# EAGLE design Root (EAGLE 9.6.2)
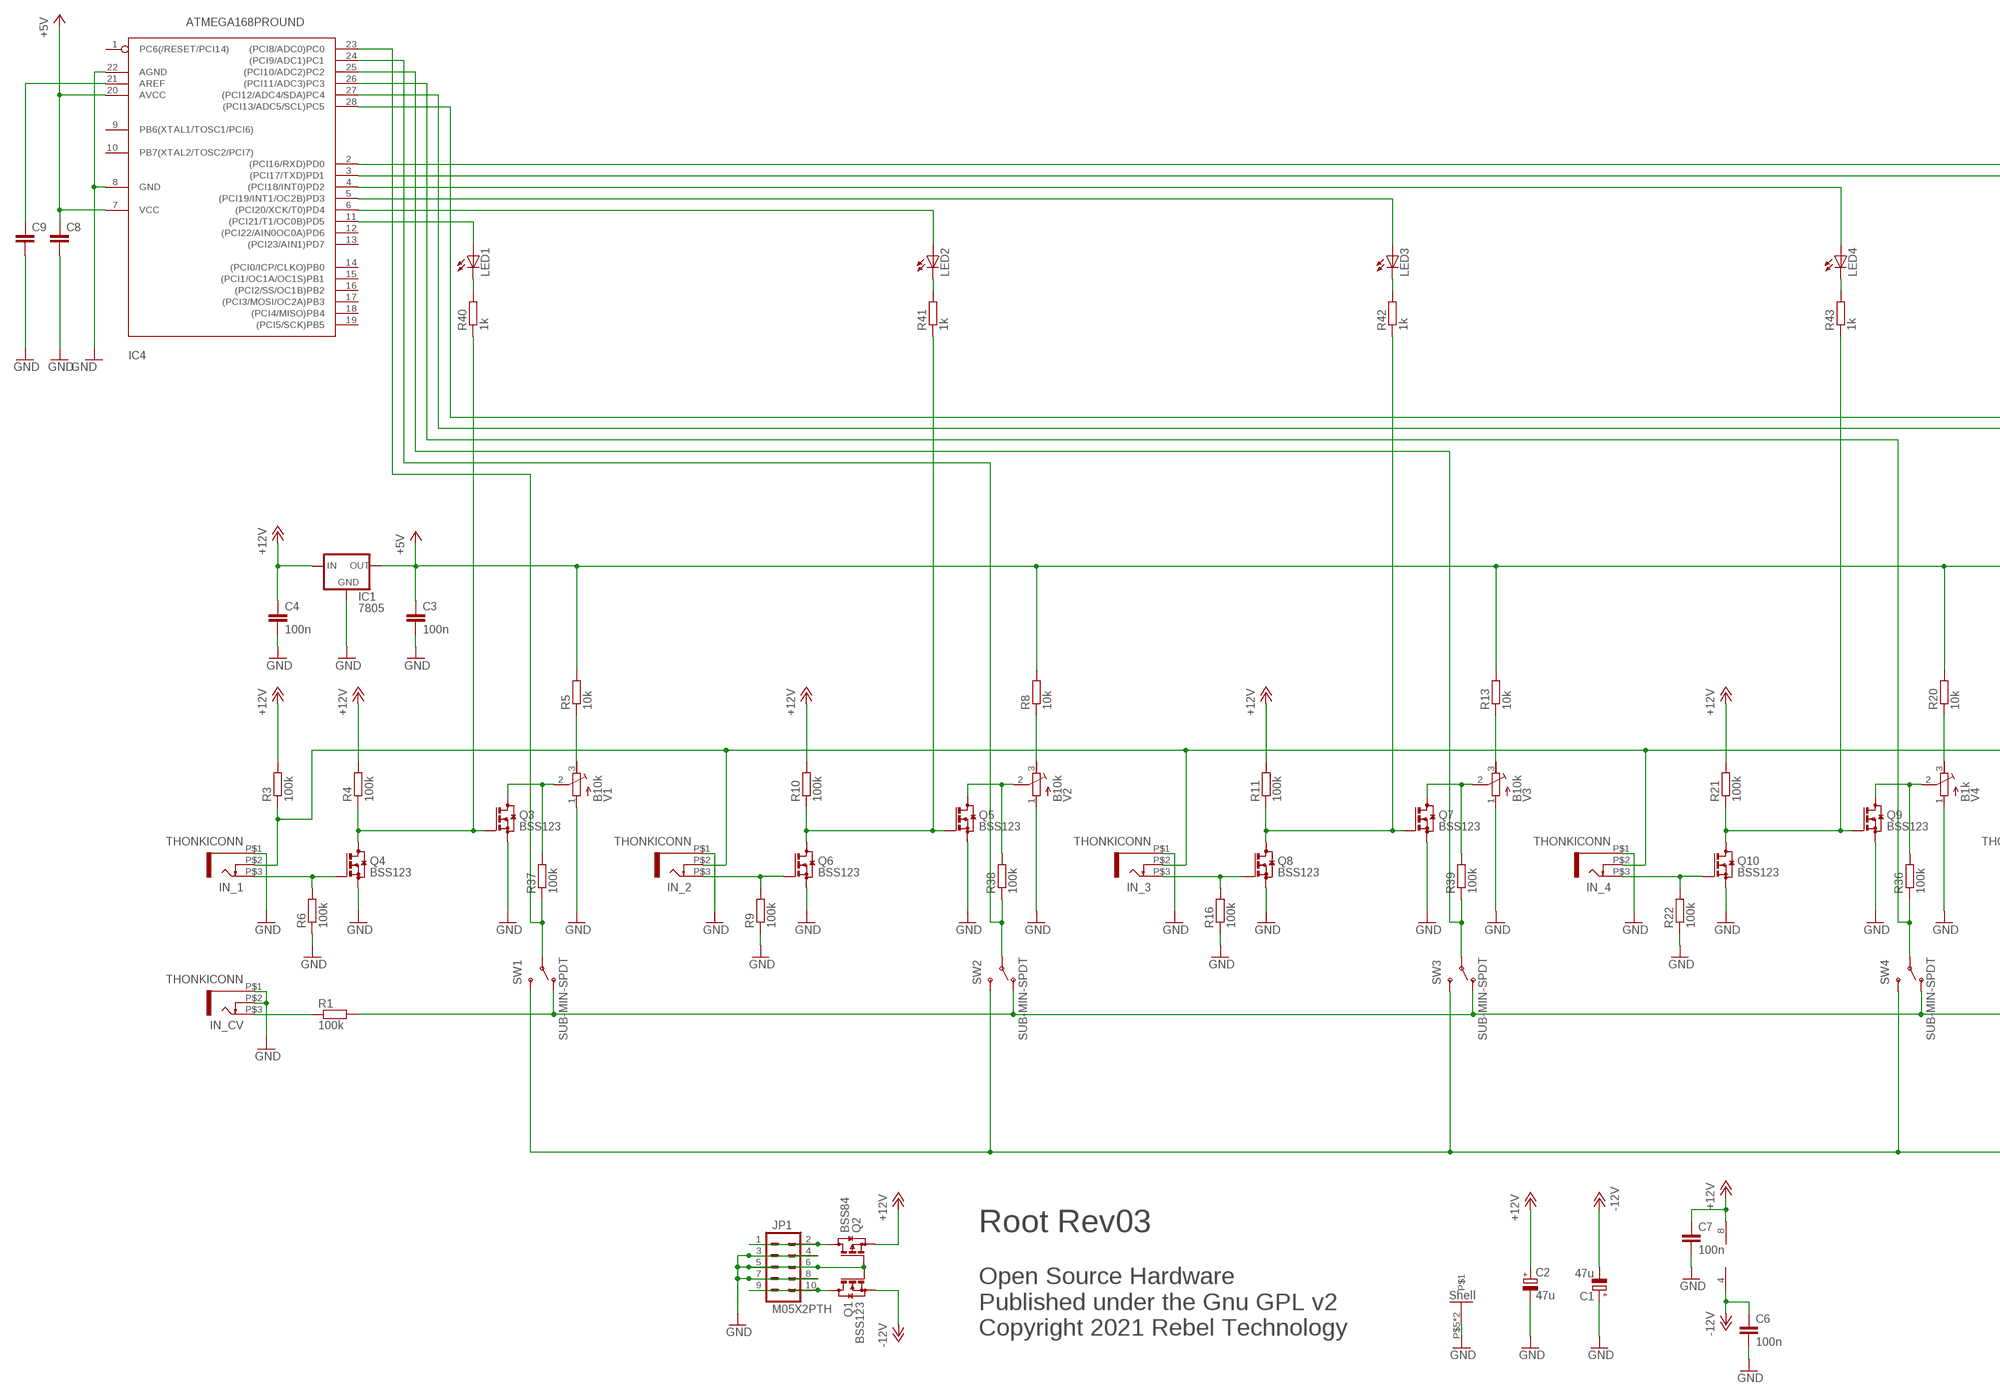
[diagram p0: schematic, sheet 1, part 1 of 2]
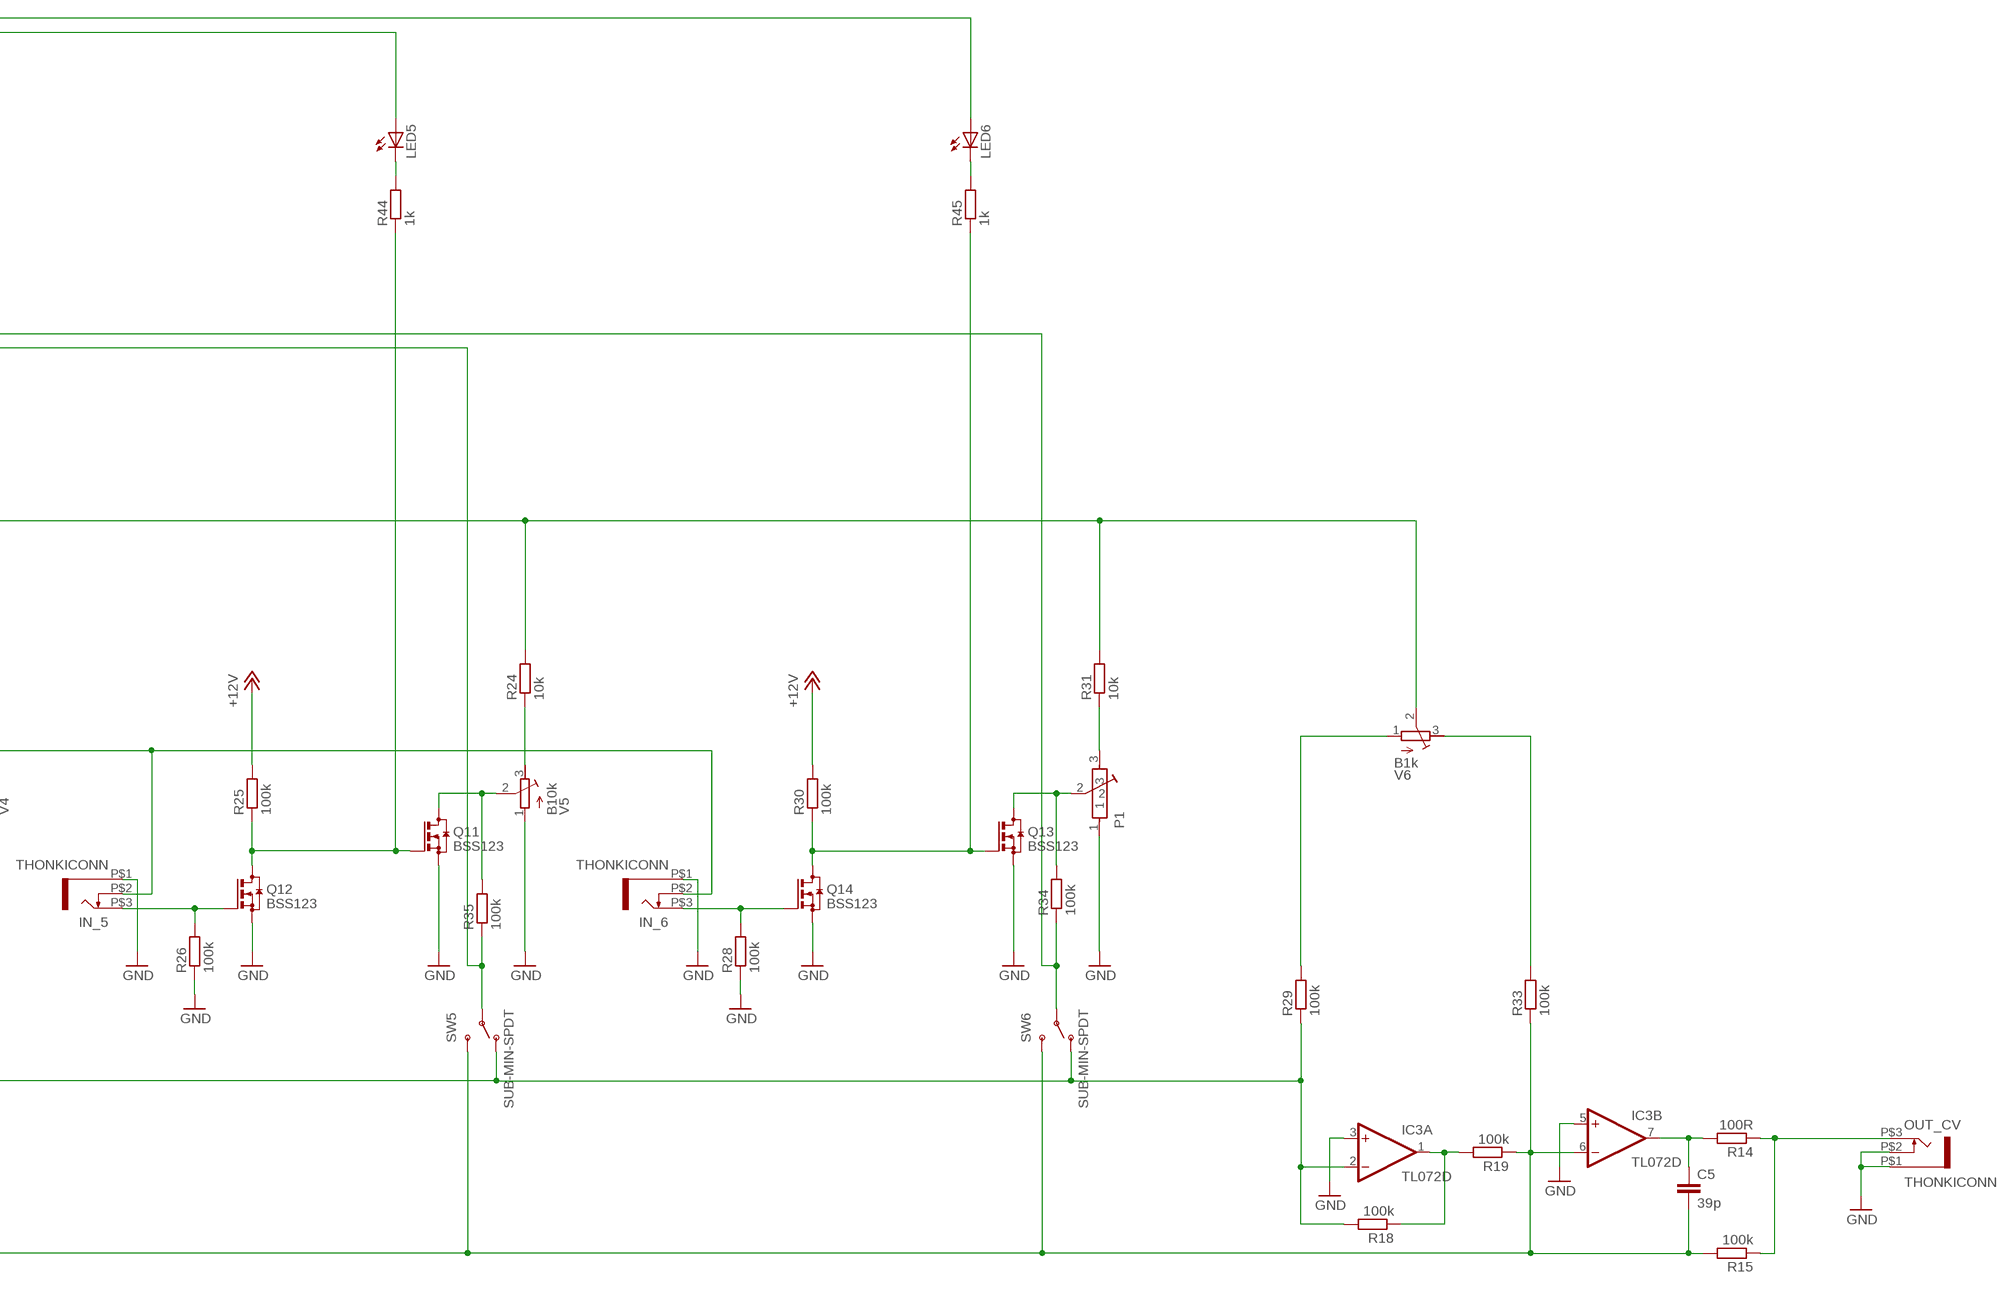
[diagram p1: schematic, sheet 1, part 2 of 2]

## Parts
C1  47u  CPOL-EUE5-6  [E5-6]
C2  47u  CPOL-EUE5-6  [E5-6]
C3  100n  C-EUC0603  [C0603]
C4  100n  C-EUC0603  [C0603]
C5  39p  C-EUC0603  [C0603]
C6  100n  C-EUC0603  [C0603]
C7  100n  C-EUC0603  [C0603]
C8  C-EUC0603  [C0603]
C9  C-EUC0603  [C0603]
IC1  7805  V_REG_78XXTO-92  [TO-92]
IC3  TL072D  [SO08]
IC4  ATMEGA168PROUND  [DIL28-3-ROUND]
IN_1  THONKICONN  [THONKICONN]
IN_2  THONKICONN  [THONKICONN]
IN_3  THONKICONN  [THONKICONN]
IN_4  THONKICONN  [THONKICONN]
IN_5  THONKICONN  [THONKICONN]
IN_6  THONKICONN  [THONKICONN]
IN_CV  THONKICONN  [THONKICONN]
JP1  M05X2PTH  [AVR_ICSP]
LED1  LED3MM  [LED3MM]
LED2  LED3MM  [LED3MM]
LED3  LED3MM  [LED3MM]
LED4  LED3MM  [LED3MM]
LED5  LED3MM  [LED3MM]
LED6  LED3MM  [LED3MM]
OUT_CV  THONKICONN  [THONKICONN]
P1  B1k  POT-ALPS-RK09L1140  [POT-ALPS-RK09L1140]
Q1  BSS123  [SOT23]
Q2  BSS84  [SOT23]
Q3  BSS123  [SOT23]
Q4  BSS123  [SOT23]
Q5  BSS123  [SOT23]
Q6  BSS123  [SOT23]
Q7  BSS123  [SOT23]
Q8  BSS123  [SOT23]
Q9  BSS123  [SOT23]
Q10  BSS123  [SOT23]
Q11  BSS123  [SOT23]
Q12  BSS123  [SOT23]
Q13  BSS123  [SOT23]
Q14  BSS123  [SOT23]
R1  100k  R-EU_0603  [0603]
R3  100k  R-EU_0603  [0603]
R4  100k  R-EU_0603  [0603]
R5  10k  R-EU_0603  [0603]
R6  100k  R-EU_0603  [0603]
R8  10k  R-EU_0603  [0603]
R9  100k  R-EU_0603  [0603]
R10  100k  R-EU_0603  [0603]
R11  100k  R-EU_0603  [0603]
R13  10k  R-EU_0603  [0603]
R14  100R  R-EU_0603  [0603]
R15  100k  R-EU_0603  [0603]
R16  100k  R-EU_0603  [0603]
R18  100k  R-EU_0603  [0603]
R19  100k  R-EU_0603  [0603]
R20  10k  R-EU_0603  [0603]
R21  100k  R-EU_0603  [0603]
R22  100k  R-EU_0603  [0603]
R24  10k  R-EU_0603  [0603]
R25  100k  R-EU_0603  [0603]
R26  100k  R-EU_0603  [0603]
R28  100k  R-EU_0603  [0603]
R29  100k  R-EU_0603  [0603]
R30  100k  R-EU_0603  [0603]
R31  10k  R-EU_0603  [0603]
R33  100k  R-EU_0603  [0603]
R34  100k  R-EU_0603  [0603]
R35  100k  R-EU_0603  [0603]
R36  100k  R-EU_0603  [0603]
R37  100k  R-EU_0603  [0603]
R38  100k  R-EU_0603  [0603]
R39  100k  R-EU_0603  [0603]
R40  1k  R-EU_0603  [0603]
R41  1k  R-EU_0603  [0603]
R42  1k  R-EU_0603  [0603]
R43  1k  R-EU_0603  [0603]
R44  1k  R-EU_0603  [0603]
R45  1k  R-EU_0603  [0603]
SW1  SUB-MIN-SPDT  [SUB-MIN-SPDT]
SW2  SUB-MIN-SPDT  [SUB-MIN-SPDT]
SW3  SUB-MIN-SPDT  [SUB-MIN-SPDT]
SW4  SUB-MIN-SPDT  [SUB-MIN-SPDT]
SW5  SUB-MIN-SPDT  [SUB-MIN-SPDT]
SW6  SUB-MIN-SPDT  [SUB-MIN-SPDT]
V1  B10k  R-TRIMM3296W  [RTRIM3296W]
V2  B10k  R-TRIMM3296W  [RTRIM3296W]
V3  B10k  R-TRIMM3296W  [RTRIM3296W]
V4  B1k  R-TRIMM3296W  [RTRIM3296W]
V5  B10k  R-TRIMM3296W  [RTRIM3296W]
V6  B1k  R-TRIMM3296W  [RTRIM3296W]

## Nets
+5V: C3.1 C8.1 IC1.3(OUT) IC4.7(VCC) IC4.20(AVCC) R5.2 R8.2 R13.2 R20.2 R24.2 R31.2 V6.2(S)
+12V: C2.+ C4.1 C7.1 IC1.2(IN) IC3.8(P:V+) Q2.2(S) R3.2 R4.2 R10.2 R11.2 R21.2 R25.2 R30.2
-12V: C1.- C6.1 IC3.4(P:V-) Q1.2(S)
GND: C1.+ C2.- C3.2 C4.2 C6.2 C7.2 C8.2 C9.2 IC1.1(GND) IC3.3(A:+IN) IC3.5(B:+IN) IC4.8(GND) IC4.22(AGND) IN_1.P$1 IN_2.P$1 IN_3.P$1 IN_4.P$1 IN_5.P$1 IN_6.P$1 IN_CV.P$1 IN_CV.P$2 JP1.3 JP1.4 JP1.5 JP1.6 JP1.7 JP1.8 OUT_CV.P$1 OUT_CV.P$2 P1.1 P1.P$5 P1.P$6 Q1.1(G) Q2.1(G) Q3.2(S) Q4.2(S) Q5.2(S) Q6.2(S) Q7.2(S) Q8.2(S) Q9.2(S) Q10.2(S) Q11.2(S) Q12.2(S) Q13.2(S) Q14.2(S) R6.1 R9.1 R16.1 R22.1 R26.1 R28.1 V1.1(A) V2.1(A) V3.1(A) V4.1(A) V5.1(A)
N$1: Q3.3(D) R37.2 V1.2(S)
N$2: OUT_CV.P$3 R14.1 R15.1
N$3: IN_1.P$3 Q4.1(G) R6.2
N$4: JP1.9 JP1.10 Q1.3(D)
N$5: R8.1 V2.3(E)
N$6: C9.1 IC4.21(AREF)
N$7: IC4.23((PCI8/ADC0)PC0) R37.1 SW1.2(P)
N$8: Q5.3(D) R38.2 V2.2(S)
N$9: Q7.3(D) R39.2 V3.2(S)
N$10: Q9.3(D) R36.2 V4.2(S)
N$11: P1.2 Q13.3(D) R34.2
N$12: Q11.3(D) R35.2 V5.2(S)
N$13: IN_2.P$3 Q6.1(G) R9.2
N$15: IN_1.P$2 IN_2.P$2 IN_3.P$2 IN_4.P$2 IN_5.P$2 IN_6.P$2 R3.1
N$16: Q5.1(G) Q6.3(D) R10.1 R41.1
N$18: IC4.24((PCI9/ADC1)PC1) R38.1 SW2.2(P)
N$20: IN_CV.P$3 R1.1
N$21: P1.3 R31.1
N$23: R13.1 V3.3(E)
N$25: Q3.1(G) Q4.3(D) R4.1 R40.1
N$26: IN_3.P$3 Q8.1(G) R16.2
N$28: Q7.1(G) Q8.3(D) R11.1 R42.1
N$29: R29.2 V6.1(A)
N$30: IC4.25((PCI10/ADC2)PC2) R39.1 SW3.2(P)
N$31: IC4.28((PCI13/ADC5/SCL)PC5) R34.1 SW6.2(P)
N$32: R20.1 V4.3(E)
N$33: C5.1 IC3.7(B:OUT) R14.2
N$34: IN_4.P$3 Q10.1(G) R22.2
N$35: IC3.1(A:OUT) R18.1 R19.2
N$36: LED3.K(C) R42.2
N$37: Q9.1(G) Q10.3(D) R21.1 R43.1
N$38: R33.2 V6.3(E)
N$39: IC4.26((PCI11/ADC3)PC3) R36.1 SW4.2(P)
N$40: LED4.K(C) R43.2
N$41: LED5.K(C) R44.2
N$42: LED6.K(C) R45.2
N$43: R24.1 V5.3(E)
N$44: R5.1 V1.3(E)
N$45: IN_5.P$3 Q12.1(G) R26.2
N$46: Q11.1(G) Q12.3(D) R25.1 R44.1
N$47: LED1.K(C) R40.2
N$48: LED2.K(C) R41.2
N$49: IC4.11((PCI21/T1/OC0B)PD5) LED1.A
N$50: IC4.27((PCI12/ADC4/SDA)PC4) R35.1 SW5.2(P)
N$51: IC4.6((PCI20/XCK/T0)PD4) LED2.A
N$52: IN_6.P$3 Q14.1(G) R28.2
N$53: IC4.5((PCI19/INT1/OC2B)PD3) LED3.A
N$54: Q13.1(G) Q14.3(D) R30.1 R45.1
N$55: IC4.4((PCI18/INT0)PD2) LED4.A
N$56: IC4.3((PCI17/TXD)PD1) LED5.A
N$57: IC4.2((PCI16/RXD)PD0) LED6.A
N$79: JP1.1 JP1.2 Q2.3(D)
NEG: C5.2 IC3.6(B:-IN) R15.2 R19.1 R33.1 SW1.3(S) SW2.3(S) SW3.3(S) SW4.3(S) SW5.3(S) SW6.3(S)
POS: IC3.2(A:-IN) R1.2 R18.2 R29.1 SW1.1(O) SW2.1(O) SW3.1(O) SW4.1(O) SW5.1(O) SW6.1(O)
Unconnected: IC4.1(PC6(/RESET/PCI14)) IC4.9(PB6(XTAL1/TOSC1/PCI6)) IC4.10(PB7(XTAL2/TOSC2/PCI7)) IC4.12((PCI22/AIN0OC0A)PD6) IC4.13((PCI23/AIN1)PD7) IC4.14((PCI0/ICP/CLKO)PB0) IC4.15((PCI1/OC1A/OC1S)PB1) IC4.16((PCI2/SS/OC1B)PB2) IC4.17((PCI3/MOSI/OC2A)PB3) IC4.18((PCI4/MISO)PB4) IC4.19((PCI5/SCK)PB5)

## Notes on the sheet
- Root Rev03
- Open Source Hardware
  Published under the Gnu GPL v2
  Copyright 2021 Rebel Technology

## Library data of the parts
C1 C2 = Rebel:CPOL-EU: POLARIZED CAPACITOR, European symbol
C3-C9 = Rebel:C-EU: CAPACITOR, European symbol
IC1 = SparkFun:V_REG_78XX: Voltage Regulator Standard 7805 5V regulator. IGO (Input Ground Output). Spark Fun Electronics SKU : COM-00107
IC3 = linear:TL072: OP AMP
IC4 = adafruit:ATMEGA168*P: MICROCONTROLLER 16 kBytes FLASH 1 kBytes SRAM 512 Bytes EEPROM USART 8-channel 10 bit ADC
IN_1-IN_6 IN_CV OUT_CV = Rebel:THONKICONN
JP1 = SparkFun:M05X2: Header 5x2 Standard 10-pin dual row 0.1" header. Commonly used with AVR-ISP. Use with Spark Fun Electronics SKU: PRT-00778
LED1-LED6 = Rebel:LED: LED
P1 = Rebel:POT-ALPS-RK09L
Q1 = transistor-small-signal:BSS123: N-CHANNEL MOS FET; OC_FARNELL: 1843725
Q2 = transistor-small-signal:BSS84: P-CHANNEL MOS FET; OC_FARNELL: 1779264
Q3-Q14 = transistor-small-signal:BSS123: N-CHANNEL MOS FET
R1 R3-R6 R8-R11 R13-R16 R18-R22 R24-R26 R28-R31 R33-R45 = Rebel:R-EU_: RESISTOR, European symbol
SW1-SW6 = Rebel:SUB-MIN-SPDT
V1-V6 = resistor:R-TRIMM: Trimm resistor

## Module TRIGGER
Ports: TR_IN(io)

### Library data of the parts

## Board
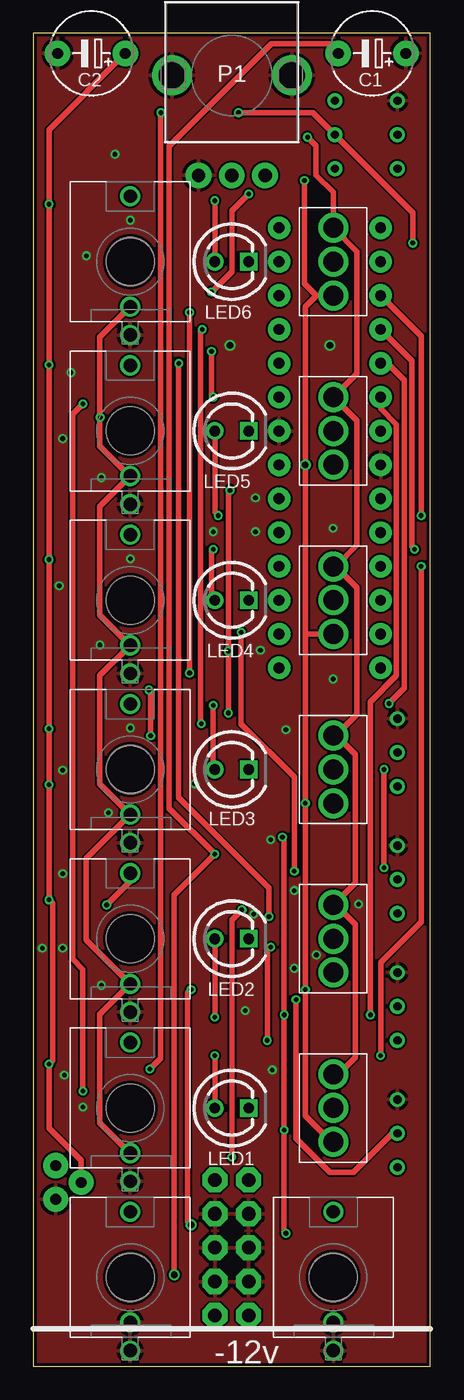
[diagram p2: board, top side]
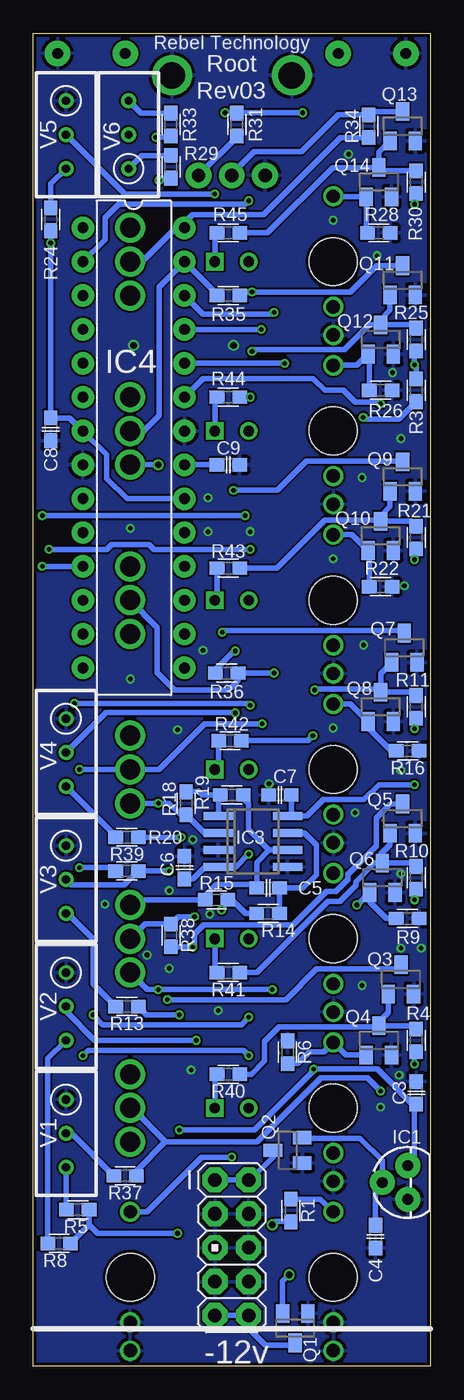
[diagram p3: board, bottom side, seen from below]

Size 29.8 x 100 mm. Coordinates in mm from the lower left corner, seen from the top.
Outline: 29.8,0 29.8,100 0,100 0,0 29.8,0
Copper layers (1*16): Top 0.035mm / dielectric 1.5mm / Bottom 0.035mm
Design rules "SeeedStudio_2layer_DRU_no_angle_20140221": minimum track width 6mil, minimum drill 12mil, track to track 6mil, track to pad 6mil, pad to pad 6mil, via to via 6mil, smd to smd 0mil, copper to edge 10mil, drill to drill 10mil, minimum pad ring 10mil, minimum via ring 6mil, stop-mask expansion 2mil, vias tented up to drill 100mil, thermal gap 10mil

### Footprints (pad centres in the part's own frame; a part is rotated, then mirrored left to right if it is on the bottom)
E5-6 = drill 0.813 pad 1.905: + -2.54,0; - 2.54,0
C0603 = smd 1.1 x 1: 1 -0.85,0; 2 0.85,0
TO-92 = drill 0.813 pad 1.88: 1 -1.27,0; 2 0,1.905; 3 1.27,0
SO08 = smd 0.6 x 2.2: 1 -1.905,-2.6; 2 -0.635,-2.6; 3 0.635,-2.6; 4 1.905,-2.6; 5 1.905,2.6; 6 0.635,2.6; 7 -0.635,2.6; 8 -1.905,2.6
DIL28-3-ROUND = drill 0.813 pad 1.676: 1 -16.51,-3.81; 2 -13.97,-3.81; 3 -11.43,-3.81; 4 -8.89,-3.81; 5 -6.35,-3.81; 6 -3.81,-3.81; 7 -1.27,-3.81; 8 1.27,-3.81; 9 3.81,-3.81; 10 6.35,-3.81; 11 8.89,-3.81; 12 11.43,-3.81; 13 13.97,-3.81; 14 16.51,-3.81; 15 16.51,3.81; 16 13.97,3.81; 17 11.43,3.81; 18 8.89,3.81; 19 6.35,3.81; 20 3.81,3.81; 21 1.27,3.81; 22 -1.27,3.81; 23 -3.81,3.81; 24 -6.35,3.81; 25 -8.89,3.81; 26 -11.43,3.81; 27 -13.97,3.81; 28 -16.51,3.81
THONKICONN = drill 1: P$1 0,-5.5; P$2 0,-3.38; P$3 0,4.92 | hole 3.6: 0,0
AVR_ICSP = drill 1.016 pad 1.88 octagon: 1 -1.27,5.08; 2 1.27,5.08; 3 -1.27,2.54; 4 1.27,2.54; 5 -1.27,0; 6 1.27,0; 7 -1.27,-2.54; 8 1.27,-2.54; 9 -1.27,-5.08; 10 1.27,-5.08
LED3MM = drill 0.813: A -1.27,0 | drill 0.813 square: K 1.27,0
POT-ALPS-RK09L1140 = drill 1 pad 1.93: 1 -2.5,-7.5; 2 0,-7.5; 3 2.5,-7.5 | drill 2: P$5 -4.5,0; P$6 4.5,0
SOT23 = smd 1 x 1.4: 1 -0.95,-1.1; 2 0.95,-1.1; 3 0,1.1
0603 = smd 1.1 x 1: 1 -0.85,0; 2 0.85,0
SUB-MIN-SPDT = drill 1.5: 1 0,-2.54; 2 0,0; 3 0,2.54
RTRIM3296W = drill 0.61: 1 0,-2.54; 2 0,0; 3 0,2.54

### Placement (x,y rotation side)
C1  25.44,98.49 180 top
C2  4.36,98.49 180 top
C3  1.06,20.51 90 bottom
C4  4.11,9.72 270 bottom
C5  12.17,35.88 180 bottom
C6  18.46,37.4 90 bottom
C7  11.28,42.86 180 bottom
C8  28.49,70.29 270 bottom
C9  15.15,67.63 0 bottom
IC1  1.69,13.78 90 bottom
IC3  13.31,39.37 270 bottom
IC4  22.27,68.9 270 bottom
IN_1  7.28,19.37 0 top
IN_2  7.28,32.07 0 top
IN_3  7.28,44.77 0 top
IN_4  7.28,57.47 0 top
IN_5  7.28,70.17 0 top
IN_6  7.28,82.87 0 top
IN_CV  7.28,6.67 0 top
JP1  14.9,8.89 0 bottom
LED1  14.9,19.37 0 top
LED2  14.9,32.07 0 top
LED3  14.9,44.77 0 top
LED4  14.9,57.47 0 top
LED5  14.9,70.17 0 top
LED6  14.9,82.87 0 top
OUT_CV  22.52,6.67 0 top
P1  14.9,96.84 0 top
Q1  10.14,2.86 180 bottom
Q2  10.71,16.19 90 bottom
Q3  2.2,29.02 0 bottom
Q4  3.85,24.45 0 bottom
Q5  2.07,41.08 0 bottom
Q6  3.6,36.64 0 bottom
Q7  1.95,53.91 0 bottom
Q8  3.72,49.47 0 bottom
Q9  2.07,66.74 0 bottom
Q10  3.72,62.29 0 bottom
Q11  2.07,81.47 0 bottom
Q12  3.72,77.03 0 bottom
Q13  2.07,93.03 0 bottom
Q14  3.85,88.84 0 bottom
R1  10.46,11.68 270 bottom
R3  1.06,73.22 90 bottom
R4  1.06,24.45 270 bottom
R5  26.46,11.75 0 bottom
R6  10.71,23.56 270 bottom
R8  27.85,9.21 0 bottom
R9  1.69,33.59 180 bottom
R10  1.06,36.64 270 bottom
R11  1.06,49.47 270 bottom
R13  22.77,26.99 0 bottom
R14  12.17,33.97 0 bottom
R15  16.04,34.99 180 bottom
R16  1.69,46.16 180 bottom
R18  18.33,42.23 270 bottom
R19  14.9,42.86 180 bottom
R20  22.77,39.69 0 bottom
R21  1.06,62.17 270 bottom
R22  3.72,58.48 180 bottom
R24  28.49,86.04 270 bottom
R25  1.06,77.03 270 bottom
R26  3.72,73.22 180 bottom
R28  3.85,85.03 180 bottom
R29  19.47,89.98 90 bottom
R30  1.06,88.84 270 bottom
R31  14.52,93.15 90 bottom
R33  19.47,93.15 90 bottom
R34  4.61,93.03 90 bottom
R35  15.15,80.33 0 bottom
R36  15.28,52.01 180 bottom
R37  22.9,14.29 180 bottom
R38  19.47,32.32 270 bottom
R39  22.77,37.15 0 bottom
R40  15.15,21.91 180 bottom
R41  15.15,29.53 180 bottom
R42  15.03,46.93 180 bottom
R43  15.15,59.88 180 bottom
R44  15.15,72.71 180 bottom
R45  15.15,85.03 180 bottom
SW1  22.52,19.37 0 top
SW2  22.52,32.07 0 top
SW3  22.52,44.77 0 top
SW4  22.52,57.47 0 top
SW5  22.52,70.17 0 top
SW6  22.52,82.87 0 top
V1  27.35,17.46 180 bottom
V2  27.35,26.99 180 bottom
V3  27.35,36.51 180 bottom
V4  27.35,46.04 180 bottom
V5  27.35,92.39 180 bottom
V6  22.65,92.39 0 bottom

### Tracks (layer width: path | path; a pad name or v marks a point on that pad's centre or on a via)
+5V  (via drill 0.35)
  Top 0.406: v15.41,94.04 21,94.04 V6.2 28.49,86.55 v28.49,84.26 | v18.71,39.69 18.84,39.56 v18.84,26.35 v18.84,17.72 18.84,10.1 v18.96,9.97 | v8.76,22.29 9.57,23.1 v9.57,94.04
  Bottom 0.406: 25.61,10.6 R5.2 | IC4.20 22.77,65.09 24.3,66.61 24.3,68.39 IC4.7 27.05,71.14 C8.1 v28.49,84.26 R24.2 | IC1.3 1.18,15.56 1.18,19.53 C3.1 1.35,19.66 3.98,22.29 v8.76,22.29 8.76,22.16 13.2,17.72 v18.84,17.72 | R31.2 14.56,94.04 | 14.56,94.04 v15.41,94.04 | R13.2 21.29,26.35 v18.84,26.35 | v9.57,94.04 14.56,94.04 | R20.2 v18.71,39.69 | v18.96,9.97 24.97,9.97 25.61,10.6 | R8.2 25.61,10.6
+12V  (via drill 0.35)
  Top 0.406: IC1.2 3.6,15.43 1.18,17.84 v1.18,22.67 1.44,22.92 1.44,34.73 v1.18,34.99 v1.18,43.62 v1.18,47.82 v1.18,60.52 v1.18,75.12 v1.18,87.19 1.18,92.77 C2.+
  Bottom 0.406: C7.1 10.43,41.56 IC3.8 9.25,41.27 8.01,42.51 4.97,42.51 3.86,43.62 v1.19,43.62 v1.18,43.62 | C4.1 4.11,13.27 IC1.2 3.6,15.43 5.26,17.1 9.56,17.1 Q2.2 | R25.2 1.18,76.05 v1.18,75.12 1.06,74.99 R3.2 | R21.2 1.18,61.19 v1.18,60.52 | R11.2 1.18,48.49 v1.18,47.82 | R10.2 1.18,35.66 v1.18,34.99 | R4.2 1.18,23.47 v1.18,22.67 | R30.2 1.18,87.86 v1.18,87.19
-12V  (via drill 0.35, 0.5)
  Top 0.406: v10.58,6.86 10.58,35.37 v13.63,38.42 10.2,41.85 10.2,91.55 17.86,99.21 22.18,99.21 C1.-
  Bottom 0.406: v13.63,38.42 14.58,37.46 IC3.4 16.91,37.46 17.82,36.55 C6.1 | Q1.2 11.09,6.35 v10.58,6.86
GND  (via drill 0.35, 0.5)
  other vias: 15.92,26.67 17.06,53.72 14.77,76.58 22.52,62.87 16.68,62.61 16.68,65.15 22.27,76.58 7.28,60.58 4.99,54.1 5.12,66.67 2.2,69.6 3.98,83.31 7.28,85.98 6.14,90.93 12.11,43.69 5.63,41.53 5.12,28.57 3.72,19.43 17.95,22.22 24.42,34.67 2.33,21.84 2.83,74.55 17.82,39.5 1.95,58.55 2.2,44.7 2.2,31.37 0.68,31.37 2.2,36.96 13.5,62.61 22.52,51.56 18.96,47.75 21.25,30.86 7.28,47.88 19.6,29.84 19.6,35.69 16.55,33.91
  pour Bottom: -1.36,-1.59 38.01,-1.59 38.01,101.28 -1.36,101.28
  pour Top: -2.63,-1.59 30.39,-1.59 30.39,101.28 -2.63,101.28
N$1  (via drill 0.35)
  Top 0.406: v19.73,27.5 19.73,17.08 22.27,14.54 24.04,14.54 26.96,17.46 V1.2
  Bottom 0.406: R37.2 26.93,17.46 V1.2 | Q3.3 2.52,29.8 8.53,29.8 10.84,27.5 v19.73,27.5
N$2  (via drill 0.35)
  Top 0.406: v15.66,34.23 14.9,33.46 v14.9,15.68
  Bottom 0.406: v14.9,15.68 17.15,15.68 21.25,11.59 OUT_CV.P$3 | R14.1 13.88,33.97 14.9,34.99 R15.1 15.19,34.82 15.66,34.35 v15.66,34.23
N$3
  Bottom 0.406: Q4.1 6.34,23.35 IN_1.P$3 7.97,23.6 9.06,23.6 9.95,22.71 R6.2
N$4
  Bottom 0.406: Q1.3 10.31,1.59 12.36,1.59 13.63,2.86 JP1.10 JP1.9
N$5
  Bottom 0.406: R8.1 28.7,23.09 V2.3
N$6
  Bottom 0.406: C9.1 IC4.21
N$7  (via drill 0.35)
  Top 0.406: v3.72,72.2 2.96,71.44 2.96,30.54 3.72,29.78 v3.72,20.64
  Bottom 0.406: v3.72,72.2 3.85,72.33 5.63,72.33 6.52,73.22 7.92,73.22 8.8,74.1 17.06,74.1 IC4.23 | v3.72,20.64 4.61,21.53 4.6,21.53 4.69,21.62 8.21,21.62 13.01,16.83 19.85,16.83 | SW1.2 22.39,19.37 19.85,16.83 | 19.85,16.83 19.89,16.83 22.05,14.67 R37.1
N$8  (via drill 0.35)
  Top 0.406: v17.57,24.45 17.57,31.18 v17.82,31.43
  Bottom 0.406: R38.2 17.86,31.47 v17.82,31.43 17.69,31.56 17.69,32.45 17.03,33.12 10.29,33.12 7.79,35.62 7.07,35.62 6.17,36.53 6.17,36.89 4.04,39.02 4.04,41.15 3,42.18 Q5.3 | v17.57,24.45 25.19,24.45 27.35,26.61 V2.2
N$9  (via drill 0.35)
  Top 0.406: v19.6,37.15 19.6,44.2 15.6,48.2 v15.6,55.05
  Bottom 0.406: V3.2 26.92,36.09 22.98,36.09 R39.2 v19.6,37.15 | Q7.3 2.13,55.2 15.46,55.2 v15.6,55.05
N$10  (via drill 0.35)
  Top 0.406: v14.77,65.72 14.65,65.6 v14.65,53.66 v14.65,49.01
  Bottom 0.406: V4.2 24.34,49.04 14.68,49.04 v14.65,49.01 | v14.77,65.72 11.47,65.72 9.3,67.9 2.13,67.9 Q9.3 | R36.2 16.13,52.26 14.73,53.66 v14.65,53.66
N$11
  Bottom 0.406: Q13.3 4.36,94.13 R34.2 6.9,93.88 9.65,91.12 13.25,91.12 14.9,89.47 P1.2
N$12  (via drill 0.35)
  Top 0.406: v16.17,87.95 14.9,86.68 14.9,82.12 v13.38,80.6
  Bottom 0.406: R35.2 14.03,80.6 v13.38,80.6 5.99,80.6 4.02,82.57 Q11.3 | V5.2 22.9,87.95 v16.17,87.95
N$13  (via drill 0.35)
  Top 0.406: v5.5,34.61 7.28,36.39 IN_2.P$3
  Bottom 0.406: R9.2 3.3,33.59 4.55,34.83 Q6.1 5.48,34.61 v5.5,34.61
N$15  (via drill 0.35)
  Top 0.406: IN_1.P$2 4.99,18.27 4.99,26.4 IN_2.P$2 3.98,31.99 3.98,38.09 IN_3.P$2 4.99,43.67 4.99,51.8 IN_4.P$2 4.99,56.37 4.99,64.5 IN_5.P$2 7.23,66.79 4.99,69.02 4.99,71.22 | 4.99,71.22 4.99,77.2 IN_6.P$2 | v5.03,71.18 4.99,71.22
  Bottom 0.406: R3.1 2.37,71.06 4.9,71.06 v5.03,71.18
N$16
  Bottom 0.406: Q6.3 3.72,37.74 3.72,38.42 3.02,39.12 Q5.1 | Q6.3 1.31,37.74 R10.1 | R41.1 13.01,29.53 7.68,34.86 6.77,34.86 5.57,36.06 5.57,36.35 4.18,37.74 Q6.3
N$18  (via drill 0.35)
  Top 0.406: v10.92,75.25 10.92,42.66 16.42,37.15 17.69,35.88 v17.69,33.72
  Bottom 0.406: IC4.24 v10.92,75.25 | SW2.2 21.42,33.17 R38.1 18.92,33.72 v17.69,33.72
N$20
  Bottom 0.406: IN_CV.P$3 8.23,12.53 R1.1
N$21
  Bottom 0.406: P1.3 14.52,92.22 R31.1
N$23
  Bottom 0.406: R13.1 25.31,28.68 25.31,32.07 27.22,33.97 V3.3
N$25
  Bottom 0.406: Q3.1 3.15,26.55 3.85,25.84 Q4.3 | R4.1 1.31,25.55 Q4.3 | Q4.3 3.94,25.46 11.35,25.46 12.44,24.37 12.44,22.89 13.43,21.91 R40.1
N$26
  Bottom 0.406: R16.2 2.92,46.16 4.67,47.92 Q8.1 6,49.69 IN_3.P$3
N$28  (via drill 0.35)
  Top 0.406: v8.8,47.31 8.8,50.61 v8.68,50.74
  Bottom 0.406: Q7.1 3.72,51.98 Q8.3 | R11.1 1.31,50.57 Q8.3 | R42.1 9.19,46.93 v8.8,47.31 | v8.68,50.74 8.62,50.8 3.96,50.8 Q8.3
N$29
  Bottom 0.406: R29.2 21.67,90.83 V6.1
N$30  (via drill 0.35)
  Top 0.406: v12.69,77.79 12.57,77.66 12.57,48.24 v12.61,48.2 | v26.33,44.77 v26.33,37.4
  Bottom 0.406: IC4.25 v12.69,77.79 | R39.1 23.88,37.4 v26.33,37.4 | v26.33,44.77 SW3.2 20.36,44.77 16.93,48.2 v12.61,48.2
N$31
  Bottom 0.406: R34.1 6.72,92.18 12.51,86.39 17.84,86.39 18.46,85.78 IC4.28 19.09,85.41 21.63,82.87 SW6.2
N$32
  Bottom 0.406: V4.3 23.62,39.78 R20.1
N$33
  Bottom 0.406: IC3.7 9.44,40.01 8.55,39.11 8.55,36.87 9.54,35.88 C5.1 R14.2
N$34
  Bottom 0.406: R22.2 4.57,61.09 Q10.1 5.87,62.39 IN_4.P$3
N$35
  Bottom 0.406: IC3.1 15.91,42.7 R19.2 17.12,42.86 17.4,43.14 R18.1
N$36
  Bottom 0.406: R42.2 15.88,45.06 LED3.K
N$37
  Bottom 0.406: Q10.3 1.43,63.39 R21.1 | Q9.1 3.02,64.5 3.72,63.79 Q10.3 | Q10.3 3.83,63.5 7.9,63.5 11.52,59.88 R43.1
N$38
  Bottom 0.406: V6.3 21.72,94 R33.2
N$39  (via drill 0.35)
  Top 0.406: v11.72,52.01 v11.72,79.06
  Bottom 0.406: v11.72,79.06 11.85,78.93 17.06,78.93 IC4.26 | SW4.2 20.49,55.44 20.49,52.05 19.18,50.74 15.15,50.74 14.43,51.46 R36.1 v11.72,52.01
N$40
  Bottom 0.406: R43.2 16,57.63 LED4.K
N$41
  Bottom 0.406: R44.2 16.17,72.54 LED5.K
N$42
  Bottom 0.406: R45.2 16.17,84.86 LED6.K
N$43
  Bottom 0.406: R24.1 28.49,88.71 V5.3
N$44
  Bottom 0.406: V1.3 27.35,11.79 R5.1
N$45
  Bottom 0.406: R26.2 4.57,75.83 Q12.1 5.51,75.09 IN_5.P$3
N$46  (via drill 0.35)
  Top 0.406: v13.38,76.14 13.38,72.83 v13.5,72.71
  Bottom 0.406: Q11.1 3.02,79.23 3.72,78.53 Q12.3 | Q12.3 1.31,78.13 R25.1 | Q12.3 4.57,78.13 6.44,76.26 13.26,76.26 v13.38,76.14 | v13.5,72.71 R44.1
N$47
  Bottom 0.406: R40.2 16.17,21.74 LED1.K
N$48
  Bottom 0.406: LED2.K 16.17,29.69 R41.2
N$49  (via drill 0.35)
  Top 0.406: LED1.A v13.63,23.3 | v26.08,23.3 26.08,30.29 29.12,33.34 v29.12,60.01
  Bottom 0.406: v13.63,23.3 14.01,23.69 25.69,23.69 v26.08,23.3 | v29.12,60.01 IC4.11
N$50
  Bottom 0.406: R35.1 16,80.42 IC4.27 20.36,80.96 20.36,71.31 21.5,70.17 SW5.2
N$51  (via drill 0.35)
  Top 0.406: IC4.6 26.08,71.86 27.27,70.66 27.27,51.8 25.31,49.85 v25.31,26.35 | LED2.A v13.63,26.18
  Bottom 0.406: v25.31,26.35 24.58,25.62 14.18,25.62 v13.63,26.18
N$52
  Bottom 0.406: R28.2 4.8,85.13 Q14.1 7.24,87.74 7.28,87.69 IN_6.P$3
N$53  (via drill 0.35)
  Top 0.406: IC4.5 26.58,75.25 27.85,73.98 27.85,50.86 v26.71,49.72 | v13.5,49.59 13.5,44.89 LED3.A
  Bottom 0.406: v26.71,49.72 13.63,49.72 v13.5,49.59
N$54
  Bottom 0.406: R30.1 3.6,89.69 Q14.3 | Q13.1 3.85,91.1 Q14.3 | Q14.3 7.32,89.94 12.23,85.03 R45.1
N$55  (via drill 0.35)
  Top 0.406: IC4.4 28.41,75.45 28.41,61.48 v28.62,61.28 | LED4.A 13.38,57.72 13.38,61.15 v13.5,61.28
  Bottom 0.406: v28.62,61.28 24.3,61.28 23.92,61.66 21.12,61.66 20.74,61.28 v13.5,61.28
N$56  (via drill 0.35)
  Top 0.406: IC4.3 29.12,77.28 v29.12,63.82 | v13.88,63.82 13.63,64.07 LED5.A
  Bottom 0.406: v29.12,63.82 v13.88,63.82
N$57  (via drill 0.35)
  Top 0.406: v13.63,87.44 LED6.A
  Bottom 0.406: v13.63,87.44 13.88,87.19 23.41,87.19 24.42,86.17 24.42,84.52 IC4.2
N$79
  Bottom 0.406: JP1.1 JP1.2 13.52,13.97 11.81,15.68 Q2.3
NEG  (via drill 0.35)
  Top 0.406: SW1.3 22.9,21.91 24.17,23.18 24.17,33.15 22.71,34.61 SW2.3 24.17,36.26 24.17,45.91 22.77,47.31 SW3.3 22.71,47.31 24.3,48.89 24.3,58.42 22.71,60.01 | 22.71,60.01 24.3,61.59 24.3,70.93 SW5.3 24.3,74.49 24.3,83.63 SW6.3 22.52,88.07 21.22,89.37 21.22,91.57 v20.59,92.2 | SW4.3 22.71,60.01
  Bottom 0.406: R19.1 14.05,42.65 13.63,42.23 13.63,40.26 12.11,38.74 12.09,38.74 | 12.09,38.74 IC3.6 | v20.59,92.2 19.57,92.2 R33.1 | SW2.3 22.14,34.99 R15.2 16.89,35.28 16.04,36.13 13.27,36.13 C5.2 13.02,37.81 12.09,38.74
POS  (via drill 0.35, 0.5)
  Top 0.406: 20.42,54.93 v20.42,67.63 20.42,79.5 21.25,80.33 | 21.25,80.33 SW6.1 | SW1.1 22.39,16.83 20.42,18.8 v20.42,28.26 v20.42,42.23 20.42,54.93 | v11.85,28.26 11.6,28 11.6,10.86 v11.85,10.6 | SW4.1 20.42,54.93 | v20.36,88.96 20.36,81.22 21.25,80.33
  Bottom 0.406: SW5.1 v20.42,67.63 | SW2.1 21.25,28.26 v20.42,28.26 v11.85,28.26 | IC3.2 16.93,40.01 18.05,41.13 18.06,41.11 R18.2 18.42,41.47 18.84,41.47 19.6,42.23 v20.42,42.23 SW3.1 | v11.85,10.6 11.6,10.86 10.48,10.86 R1.2 | R29.1 20.19,89.13 v20.36,88.96

### Text on the board
tPlace: -12v
bPlace: Rebel Technology | Root | Rev03 | -12v